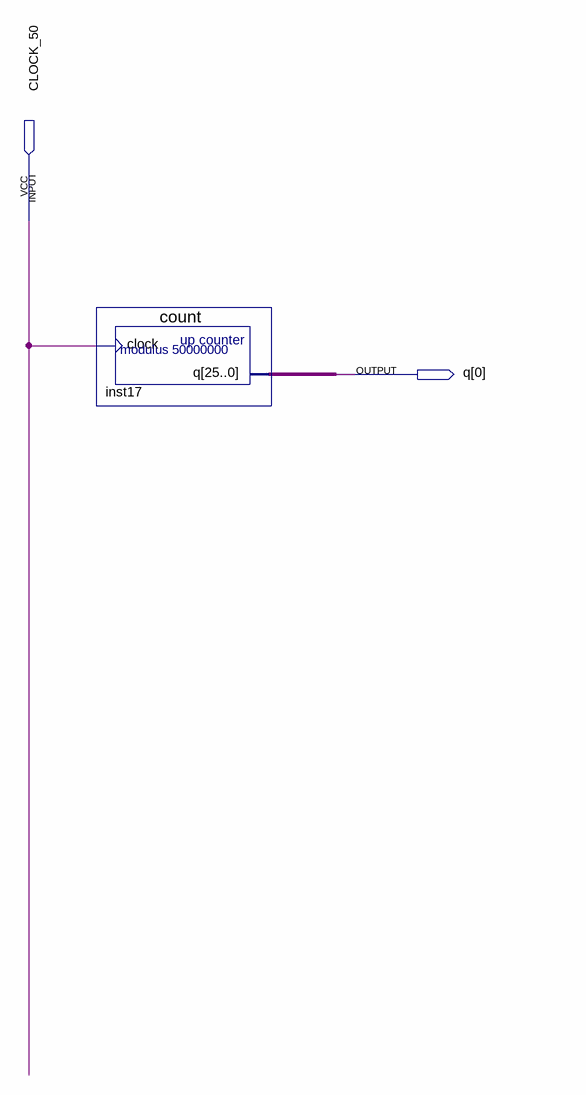
[diagram p0: schematic sheet]
// Quartus schematic clock_mod.bdf as structural Verilog: 1 symbols, 2 pins
module clock_mod (
  input  CLOCK_50,
  output [0:0] q
);

  wire [25:0] inst17_q;

  count inst17 (.clock(CLOCK_50), .q(inst17_q));
endmodule
